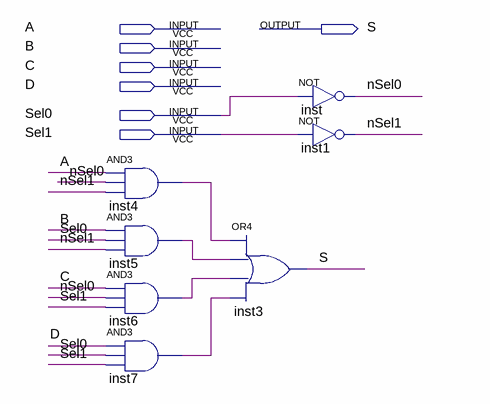
[diagram p0: schematic sheet]
// Quartus schematic multiplex4pra1.bdf as structural Verilog: 7 symbols, 7 pins
module multiplex4pra1 (
  input  A,
  input  B,
  input  C,
  input  D,
  input  Sel0,
  input  Sel1,
  output S
);

  wire inst4_out, inst5_out, inst6_out, inst7_out, nSel0, nSel1;

  and inst4 (inst4_out, A, nSel0, nSel1);
  and inst5 (inst5_out, B, Sel0, nSel1);
  and inst6 (inst6_out, C, nSel0, Sel1);
  and inst7 (inst7_out, D, Sel0, Sel1);
  or inst3 (S, inst4_out, inst5_out, inst6_out, inst7_out);
  not inst (nSel0, Sel0);
  not inst1 (nSel1, Sel1);
endmodule
